# Altium schematic sheet Sheet1.SchDoc: nRF52840 Nano Development Kit
size A3; Author: D.N.Nhuan; DrawnBy: D.N.Nhuan; Organization: Public; Address1: L3, 12a Rodborough Rd; Address2: Frenchs Forest; Address3: NSW; Address4: Australia 2086; Revision: 2.0.0; SheetNumber: 1; SheetTotal: 1
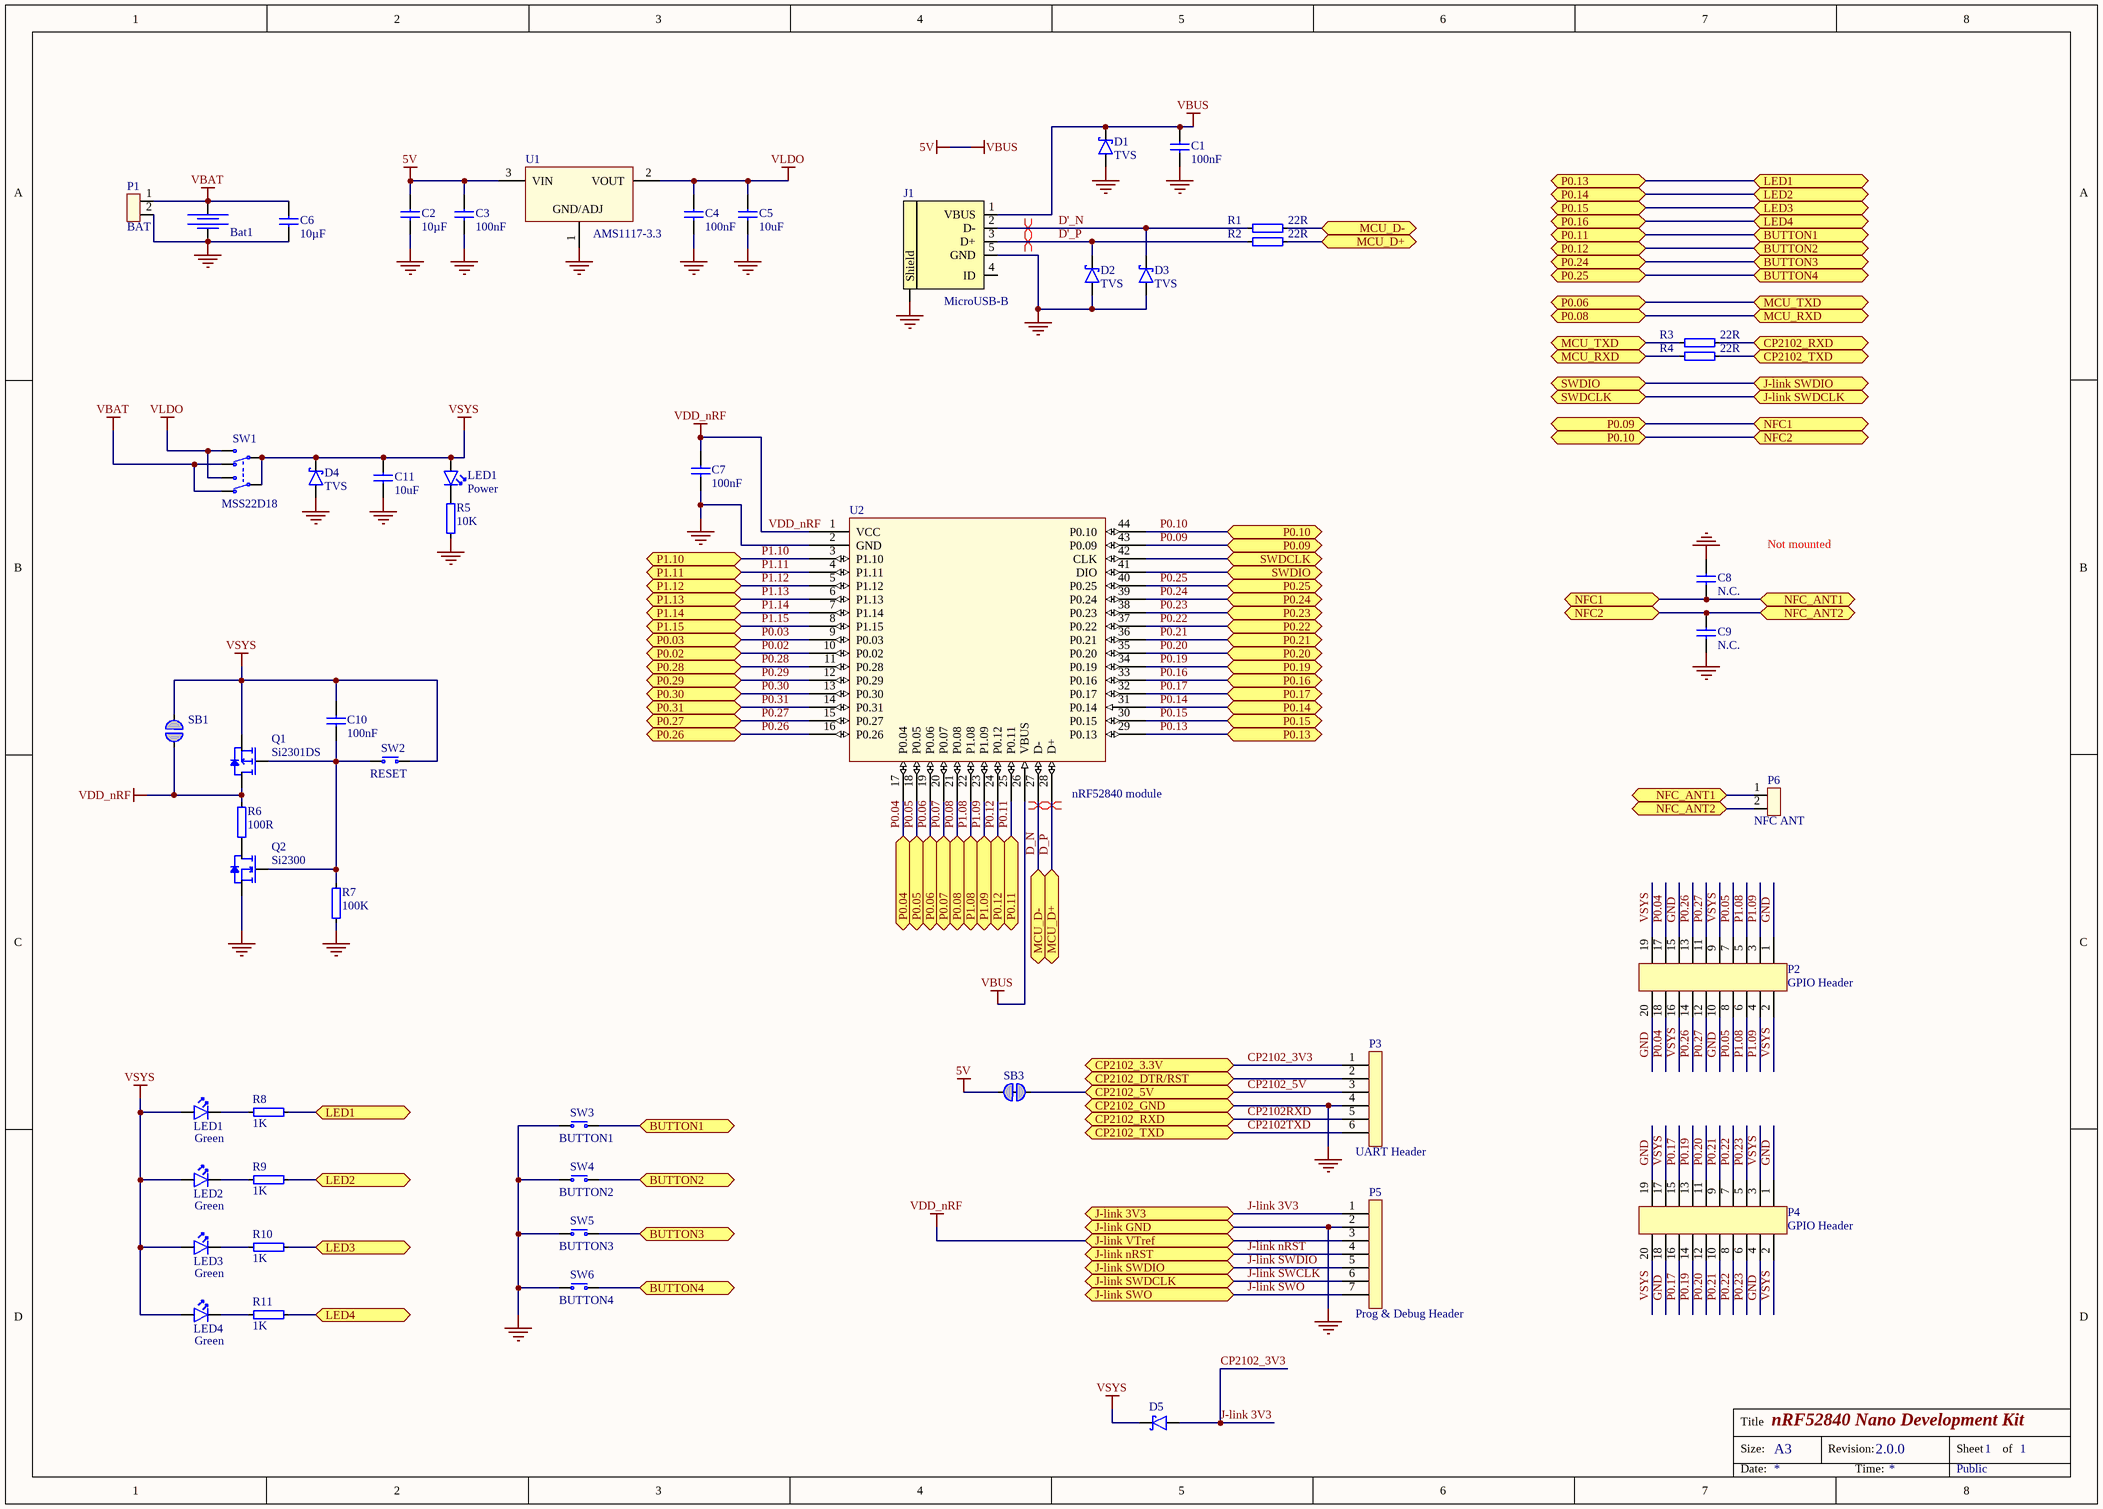
[diagram p0: Sheet1.SchDoc]

## Parts
Bat1  Bat Holder CR2032  [CR2032_DIP_PLASTIC]  (value not drawn)
C1  100nF  [0805_Imperial]
C2  10µF  [0805_Imperial]
C3  100nF  [0805_Imperial]
C4  100nF  [0805_Imperial]
C5  10uF  [0805_Imperial]
C6  10µF  [0805_Imperial]
C7  100nF  [0805_Imperial]
C8  N.C.  [0402 imperial]
C9  N.C.  [0402 imperial]
C10  100nF  [0805_Imperial]
C11  10uF  [0805_Imperial]
D1  TVS  [DO-214AC]
D2  TVS  [DO-214AC]
D3  TVS  [DO-214AC]
D4  TVS  [DO-214AC]
D5  DIODE  [SOD-123]  (value not drawn)
J1  MicroUSB-B  [USB-MICRO-B-MODULE]
LED1  Power  [LED_0805]
LED2  LED1  Color: Green  [LED_0805]
LED3  LED2  Color: Green  [LED_0805]
LED4  LED3  Color: Green  [LED_0805]
LED5  LED4  Color: Green  [LED_0805]
P1  BAT  [CONN2.54MM2P]
P2  GPIO Header  [CONN2.54MM10X2]
P3  UART Header  [CONNX2.54MM6P]
P4  GPIO Header  [CONN2.54MM10X2]
P5  Prog & Debug Header  [CONN2.54MM7P]
P6  NFC ANT  [CONN2.54MM2P]
Q1  Si2301DS  [SOT-23]
Q2  Si2300  [SOT-23]
R1  22R  [0805_Imperial]
R2  22R  [0805_Imperial]
R3  22R  [0805_Imperial]
R4  22R  [0805_Imperial]
R5  10K  [0805_Imperial]
R6  100R  [0805_Imperial]
R7  100K  [0805_Imperial]
R8  1K  [0805_Imperial]
R9  1K  [0805_Imperial]
R10  1K  [0805_Imperial]
R11  1K  [0805_Imperial]
SB1  Solderbridge  [Solderbridge_Small]  (value not drawn)  (no BOM)
SB3  Solderbridge  [Solderbridge_Shorted]  (value not drawn)  (net tie, no BOM)
SW1  MSS22D18  [MSS22D18DIP]
SW2  RESET  [Switch-PB-6.2x6.2-2-PIN-DIP]
SW3  BUTTON1  [Switch-PB-6.2x6.2-2-PIN-DIP]
SW4  BUTTON2  [Switch-PB-6.2x6.2-2-PIN-DIP]
SW5  BUTTON3  [Switch-PB-6.2x6.2-2-PIN-DIP]
SW6  BUTTON4  [Switch-PB-6.2x6.2-2-PIN-DIP]
U1  AMS1117-3.3  [SOT229P700X180-4N]
U2  nRF52840 module  [nRF52840_GT840A01]

## Ports
BUTTON1, BUTTON1 (bidir), BUTTON2, BUTTON2 (bidir), BUTTON3, BUTTON3 (bidir), BUTTON4, BUTTON4 (bidir), CP2102_3.3V, CP2102_5V, CP2102_DTR/RST, CP2102_GND, CP2102_RXD, CP2102_TXD, J-link 3V3, J-link GND, J-link nRST, J-link SWDCLK, J-link SWDIO, J-link SWO, J-link VTref, LED1, LED1 (bidir), LED2, LED2 (bidir), LED3, LED3 (bidir), LED4, LED4 (bidir), MCU_D+, MCU_D-, MCU_RXD, MCU_TXD, NFC1, NFC2, NFC_ANT1, NFC_ANT2, P0.02, P0.03, P0.04, P0.05, P0.06, P0.07, P0.08, P0.09, P0.10, P0.11, P0.12, P0.13, P0.14, P0.15, P0.16, P0.17, P0.19, P0.20, P0.21, P0.22, P0.23, P0.24, P0.25, P0.26, P0.27, P0.28, P0.29, P0.30, P0.31, P1.08, P1.09, P1.10, P1.11, P1.12, P1.13, P1.14, P1.15, SWDCLK, SWDCLK (bidir), SWDIO, SWDIO (bidir)

## Nets
5V: C1.2 C2.2 C3.2 D1.1(C) J1.1(VBUS) SB3.2 U1.3(VIN) U2.26(VBUS)  [also labelled VBUS]
GND: Bat1.2 C1.1 C2.1 C3.1 C4.1 C5.1 C6.1 C7.1 C8.2 C9.1 C11.1 D1.2(A) D2.2(A) D3.2(A) D4.2(A) J1.5(GND) J1.6(Shield) P1.2 P2.1 P2.10 P2.15 P2.20 P3.4 P4.1 P4.4 P4.18 P4.19 P5.2 Q2.2(S) R5.1 R7.1 SW3.1(N.O) SW4.1(N.O) SW5.1(N.O) SW6.1(N.O) U1.1(ADJ/GND) U2.2(GND) ; port CP2102_GND, port J-link GND
VBAT: Bat1.1 C6.2 P1.1 SW1.3(N.C-1) SW1.6(N.C-2)
VDD_nRF: C7.2 P5.3 Q1.3(D) R6.2 SB1.2 U2.1(VCC) ; port J-link VTref
VLDO: C4.2 C5.2 SW1.1(N.O-1) SW1.4(N.O-2) U1.2(VOUT)
VSYS: C10.2 C11.2 D4.1(C) D5.1(C) LED1.2(A) LED2.2(A) LED3.2(A) LED4.2(A) LED5.2(A) P2.2 P2.9 P2.16 P2.19 P4.2 P4.3 P4.17 P4.20 Q1.2(S) SB1.1 SW1.2(COM-1) SW1.5(COM-2) SW2.2(COM)
CP2102_3V3: D5.2(A) P3.1 P5.1 ; port CP2102_3.3V, port J-link 3V3  [also labelled J-link 3V3]
CP2102_5V: P3.3 SB3.1 ; port CP2102_5V
CP2102_DTR/RST: P3.2 ; port CP2102_DTR/RST
CP2102RXD: P3.5 R3.2 ; port CP2102_RXD
CP2102TXD: P3.6 R4.2 ; port CP2102_TXD
D'_N: D3.1(C) J1.2(D-) R1.1
D'_P: D2.1(C) J1.3(D+) R2.1
D_N: R1.2 U2.27(D-) ; port MCU_D-
D_P: R2.2 U2.28(D+) ; port MCU_D+
J-link nRST: P5.4 ; port J-link nRST
J-link SWCLK: P5.6 U2.42(CLK) ; port J-link SWDCLK, port SWDCLK
J-link SWDIO: P5.5 U2.41(DIO) ; port J-link SWDIO, port SWDIO
J-link SWO: P5.7 ; port J-link SWO
P0.02: U2.10(P0.02) ; port P0.02
P0.03: U2.9(P0.03) ; port P0.03
P0.04: P2.17 P2.18 U2.17(P0.04) ; port P0.04
P0.05: P2.7 P2.8 U2.18(P0.05) ; port P0.05
P0.06: R3.1 U2.19(P0.06) ; port P0.06, port MCU_TXD
P0.07: U2.20(P0.07) ; port P0.07
P0.08: R4.1 U2.21(P0.08) ; port P0.08, port MCU_RXD
P0.09: C8.1 P6.1 U2.43(P0.09) ; port P0.09, port NFC1, port NFC_ANT1
P0.10: C9.2 P6.2 U2.44(P0.10) ; port P0.10, port NFC2, port NFC_ANT2
P0.11: SW3.2(COM) U2.25(P0.11) ; port BUTTON1, port P0.11
P0.12: SW4.2(COM) U2.24(P0.12) ; port BUTTON2, port P0.12
P0.13: R8.2 U2.29(P0.13) ; port LED1, port P0.13
P0.14: R9.2 U2.31(P0.14) ; port LED2, port P0.14
P0.15: R10.2 U2.30(P0.15) ; port LED3, port P0.15
P0.16: R11.2 U2.33(P0.16) ; port LED4, port P0.16
P0.17: P4.15 P4.16 U2.32(P0.17) ; port P0.17
P0.19: P4.13 P4.14 U2.34(P0.19) ; port P0.19
P0.20: P4.11 P4.12 U2.35(P0.20) ; port P0.20
P0.21: P4.9 P4.10 U2.36(P0.21) ; port P0.21
P0.22: P4.7 P4.8 U2.37(P0.22) ; port P0.22
P0.23: P4.5 P4.6 U2.38(P0.23) ; port P0.23
P0.24: SW5.2(COM) U2.39(P0.24) ; port BUTTON3, port P0.24
P0.25: SW6.2(COM) U2.40(P0.25) ; port BUTTON4, port P0.25
P0.26: P2.13 P2.14 U2.16(P0.26) ; port P0.26
P0.27: P2.11 P2.12 U2.15(P0.27) ; port P0.27
P0.28: U2.11(P0.28) ; port P0.28
P0.29: U2.12(P0.29) ; port P0.29
P0.30: U2.13(P0.30) ; port P0.30
P0.31: U2.14(P0.31) ; port P0.31
P1.08: P2.5 P2.6 U2.22(P1.08) ; port P1.08
P1.09: P2.3 P2.4 U2.23(P1.09) ; port P1.09
P1.10: U2.3(P1.10) ; port P1.10
P1.11: U2.4(P1.11) ; port P1.11
P1.12: U2.5(P1.12) ; port P1.12
P1.13: U2.6(P1.13) ; port P1.13
P1.14: U2.7(P1.14) ; port P1.14
P1.15: U2.8(P1.15) ; port P1.15
NetC10_1: C10.1 Q1.1(G) Q2.1(G) R7.2 SW2.1(N.O)
NetLED1_1: LED1.1(C) R5.2
NetLED2_1: LED2.1(C) R8.1
NetLED3_1: LED3.1(C) R9.1
NetLED4_1: LED4.1(C) R10.1
NetLED5_1: LED5.1(C) R11.1
NetQ2_3: Q2.3(D) R6.1

Not connected (* = marked no-connect by the designer): J1 4(ID)

## Layout directives
differential pair: D'_N, D'_P, D_N, D_P

## Notes on the sheet
- Not mounted
- Title
- Size:
- A3
- Revision:
- Sheet
- of
- Date:
- Time:
- (in symbol AMS1117) GND/ADJ

## Library data of the parts
Bat1 = Bat Holder CR2032: Bat Holder CR2032 SMD; Note: Bat Holder CR2032
C1-C9 C11 = Capacitor: common library; Tolerance: ±5%; Link of Supplier: *; Manufacturer: *; Manufacturer Part Number: *; Voltage Rating: *
  C1 C3 C4 C7: Value: 100nF
  C2 C6: Value: 10µF
  C5 C11: Value: 10uF
  C8 C9: Value: N.C.
C10 = Capacitor: Genaral Schematic; Tolerance: ±5%; Value: 100nF; Suppiler: *; Link of Supplier: *; Manufacturer: *; Manufacturer Part Number: *; Footprint: 0402
D1-D5 = Diode: common library; Note: *
  D1-D4: Value: TVS
  D5: Value: DIODE
J1 = MicroUSB-AB-SMT: MicroUSB-B-SMT; Part Number: USB-Micro-B-RA-SMD-PiP; Manufacturer: Allen Creations Corp.; Manufacturer Part Number: AJU55-BS2111-L; 2nd source part number: 609-4616-1-ND; Part number IPS: 00000007790; Artikkelnr Noca: 55029020; Artikkelnr Simpro: N.A.; Datasheet: \\hizz\pro\app9717\Datasheet\connectores\Allen Creations Corp\AJU-211.pdf; Footprint Doc: USB-Micro-B-RA-SMD-PiP; LatestRevisionDate: 2016-04-21; Pin Count: 5; Publisher: Nordic Semiconductor; Published: 2014-10-07; Value: MicroUSB-B; Note: *; Supplier: Cabcon; Supplier part number: AJU55-BS2111-L; 2nd source Supplier: Digi-Key
LED1 = LED: common library; Color: Green; Footprint: 0603; Function: Power
LED2-LED5 = LED: common library; Footprint: 0603
  LED2: Function: LED1
  LED3: Function: LED2
  LED4: Function: LED3
  LED5: Function: LED4
P1 P6 = Header 2
  P1: Value: BAT
  P6: Value: NFC ANT
P2 P4 = Header 10x2: Value: GPIO Header
P3 = Header 6: common library; Compatibility: Pinout of CP2102 USB-UART Module ( at hshop.vn); Value: UART Header
P5 = Header 7: Value: Prog & Debug Header
Q1 = MOS-P: SOT-23 1-G 2-S 3-D
Q2 = MOS-N: SOT-23 1-G 2-S 3-D
R1-R5 R8-R11 = Resistor: common library; Tolerance: ±5%; Link of Supplier: *; Power Rating: *
  R1-R4: Value: 22R
  R5: Value: 10K
  R8-R11: Value: 1K
R6 R7 = Resistor: General Schematic; Tolerance: ±5%; Supplier: *; Link of Supplier: *; Footprint: 0402
  R6: Value: 100R
  R7: Value: 100K
SB1 = Solderbridge: Artikkelnr Noca: N.A.; Part Number: Solderbridge; Manufacturer: *; Manufacturer Part Number: *; Datasheet: *; LatestRevisionDate: 2009-12-14; Pin Count: 2; Publisher: Nordic Semiconductor; Published: 2009-12-14; Value: Solderbridge; Note: *; Supplier: *; Supplier part number: *; 2nd source Supplier: *; 2nd source part number: *; Footprint Doc: Solderbridge; Artikkelnr Simpro: N.A.
SB3 = SolderbridgeShorted: Shorted Solderbridge; Artikkelnr Noca: N.A.; Part Number: Solderbridge Shorted; Manufacturer: *; Manufacturer Part Number: *; Datasheet: *; LatestRevisionDate: 2012-08-07; Pin Count: 2; Publisher: Nordic Semiconductor; Published: 2012-08-07; Value: Solderbridge; Note: *; Supplier: *; Supplier part number: *; 2nd source Supplier: *; 2nd source part number: *; Footprint Doc: Solderbridge_Shorted; Artikkelnr Simpro: N.A.
SW1 = Switch: slide switch, DPDT; Part Number: *; Manufacturer Part Number: *; Pin Count: 6; Value: MSS22D18; Note: *
SW2-SW6 = Push-Button-2: 2-pin
  SW2: Value: RESET
  SW3: Value: BUTTON1
  SW4: Value: BUTTON2
  SW5: Value: BUTTON3
  SW6: Value: BUTTON4
U1 = AMS1117: Low-dropout regulator; Type: AMS1117-3.3
U2 = nRF52840_GT840A01: nRF52840 module GT840A_01